# Altium schematic sheet Top Level.SchDoc
size A3; SheetNumber: 1; SheetTotal: 5
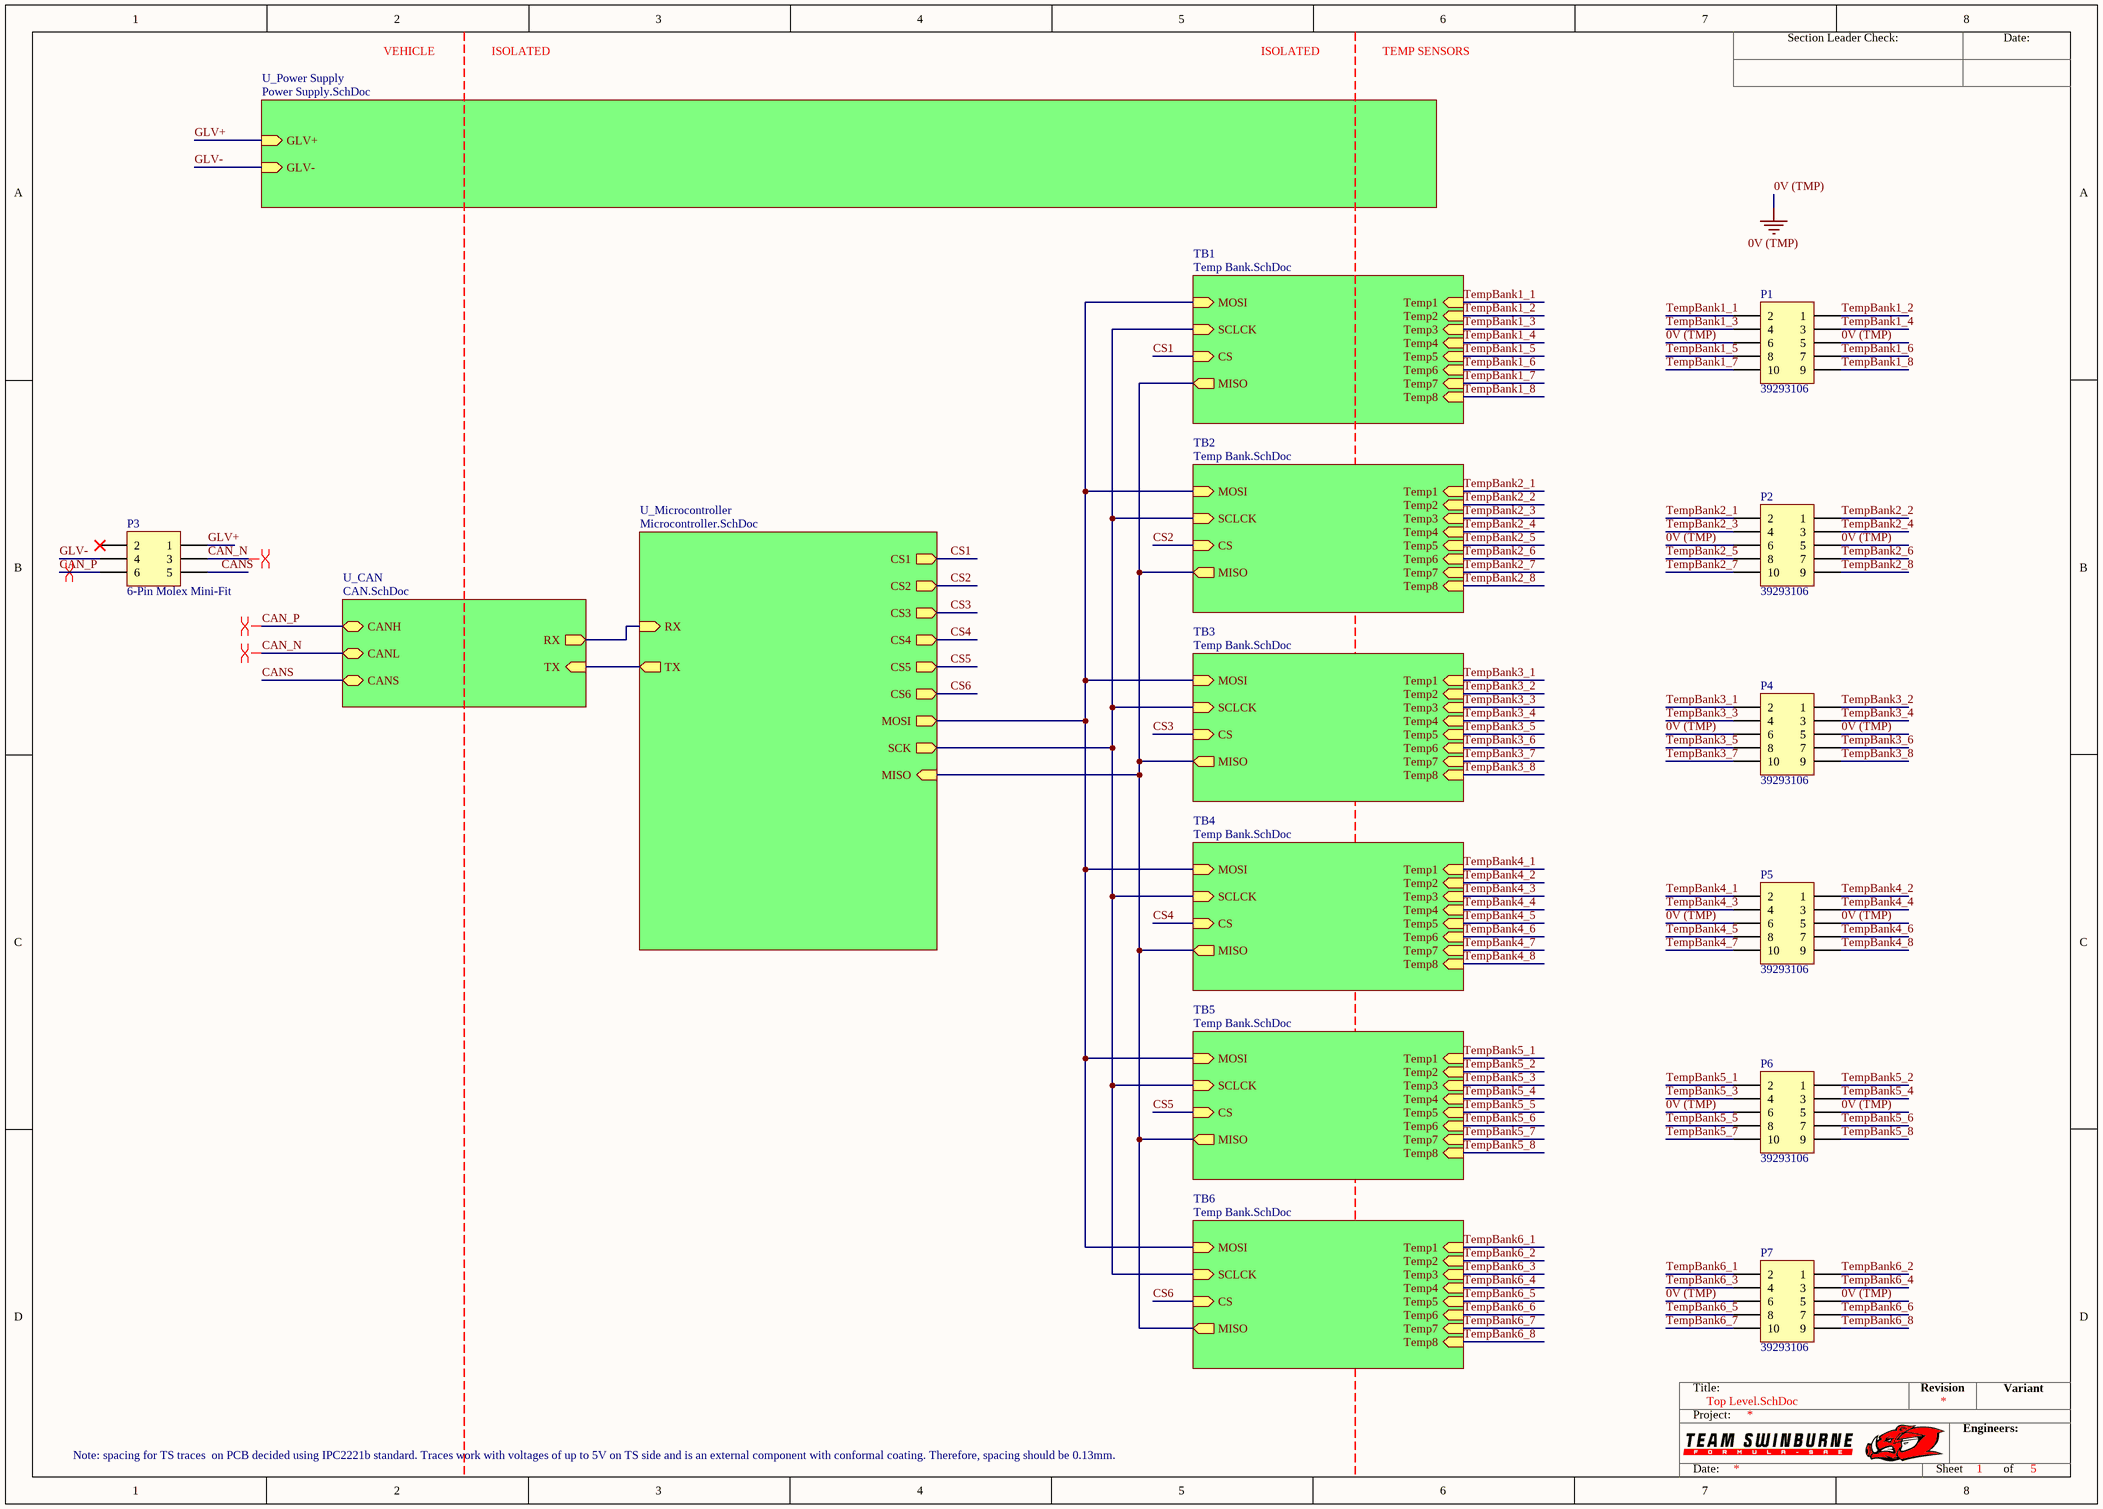
[diagram p0: Top Level.SchDoc]

## Parts
P1  39293106  [39293106]
P2  39293106  [39293106]
P3  6-Pin Molex Mini-Fit  [6-Pin Molex Mini-Fit]
P4  39293106  [39293106]
P5  39293106  [39293106]
P6  39293106  [39293106]
P7  39293106  [39293106]

## Sub-sheets
TB1 = Temp Bank.SchDoc: MOSI (in), SCLCK (in), CS (in), MISO (out), Temp4 (in), Temp5 (in), Temp6 (in), Temp1 (in), Temp2 (in), Temp3 (in), Temp7 (in), Temp8 (in)
TB2 = Temp Bank.SchDoc: MOSI (in), SCLCK (in), CS (in), MISO (out), Temp1 (in), Temp2 (in), Temp3 (in), Temp4 (in), Temp5 (in), Temp6 (in), Temp7 (in), Temp8 (in)
TB3 = Temp Bank.SchDoc: MOSI (in), SCLCK (in), CS (in), MISO (out), Temp1 (in), Temp2 (in), Temp3 (in), Temp4 (in), Temp5 (in), Temp6 (in), Temp7 (in), Temp8 (in)
TB4 = Temp Bank.SchDoc: MOSI (in), SCLCK (in), CS (in), MISO (out), Temp1 (in), Temp2 (in), Temp3 (in), Temp4 (in), Temp5 (in), Temp6 (in), Temp7 (in), Temp8 (in)
TB5 = Temp Bank.SchDoc: MOSI (in), SCLCK (in), CS (in), MISO (out), Temp1 (in), Temp2 (in), Temp3 (in), Temp4 (in), Temp5 (in), Temp6 (in), Temp7 (in), Temp8 (in)
TB6 = Temp Bank.SchDoc: MOSI (in), SCLCK (in), CS (in), MISO (out), Temp1 (in), Temp2 (in), Temp3 (in), Temp4 (in), Temp5 (in), Temp6 (in), Temp7 (in), Temp8 (in)
U_CAN = CAN.SchDoc: CANH (bidir), RX (out), TX (in), CANL (bidir), CANS (bidir)
U_Microcontroller = Microcontroller.SchDoc: CS1 (out), CS2 (out), CS3 (out), CS4 (out), CS5 (out), MOSI (out), CS6 (out), SCK (out), RX (in), TX (out), MISO (in)
U_Power Supply = Power Supply.SchDoc: GLV+ (in), GLV- (in)

## Nets
0V (TMP): P1.5 P1.6 P2.5 P2.6 P4.5 P4.6 P5.5 P5.6 P6.5 P6.6 P7.5 P7.6
CAN_N: P3.3 ; sheet U_CAN/CANL
CAN_P: P3.6 ; sheet U_CAN/CANH
CANS: P3.5 ; sheet U_CAN/CANS
CS1: sheet U_Microcontroller/CS1, sheet TB1/CS
CS2: sheet U_Microcontroller/CS2, sheet TB2/CS
CS3: sheet U_Microcontroller/CS3, sheet TB3/CS
CS4: sheet U_Microcontroller/CS4, sheet TB4/CS
CS5: sheet U_Microcontroller/CS5, sheet TB5/CS
CS6: sheet U_Microcontroller/CS6, sheet TB6/CS
GLV+: P3.1 ; sheet U_Power Supply/GLV+
GLV-: P3.4 ; sheet U_Power Supply/GLV-
TempBank1_1: P1.2 ; sheet TB1/Temp1
TempBank1_2: P1.1 ; sheet TB1/Temp2
TempBank1_3: P1.4 ; sheet TB1/Temp3
TempBank1_4: P1.3 ; sheet TB1/Temp4
TempBank1_5: P1.8 ; sheet TB1/Temp5
TempBank1_6: P1.7 ; sheet TB1/Temp6
TempBank1_7: P1.10 ; sheet TB1/Temp7
TempBank1_8: P1.9 ; sheet TB1/Temp8
TempBank2_1: P2.2 ; sheet TB2/Temp1
TempBank2_2: P2.1 ; sheet TB2/Temp2
TempBank2_3: P2.4 ; sheet TB2/Temp3
TempBank2_4: P2.3 ; sheet TB2/Temp4
TempBank2_5: P2.8 ; sheet TB2/Temp5
TempBank2_6: P2.7 ; sheet TB2/Temp6
TempBank2_7: P2.10 ; sheet TB2/Temp7
TempBank2_8: P2.9 ; sheet TB2/Temp8
TempBank3_1: P4.2 ; sheet TB3/Temp1
TempBank3_2: P4.1 ; sheet TB3/Temp2
TempBank3_3: P4.4 ; sheet TB3/Temp3
TempBank3_4: P4.3 ; sheet TB3/Temp4
TempBank3_5: P4.8 ; sheet TB3/Temp5
TempBank3_6: P4.7 ; sheet TB3/Temp6
TempBank3_7: P4.10 ; sheet TB3/Temp7
TempBank3_8: P4.9 ; sheet TB3/Temp8
TempBank4_1: P5.2 ; sheet TB4/Temp1
TempBank4_2: P5.1 ; sheet TB4/Temp2
TempBank4_3: P5.4 ; sheet TB4/Temp3
TempBank4_4: P5.3 ; sheet TB4/Temp4
TempBank4_5: P5.8 ; sheet TB4/Temp5
TempBank4_6: P5.7 ; sheet TB4/Temp6
TempBank4_7: P5.10 ; sheet TB4/Temp7
TempBank4_8: P5.9 ; sheet TB4/Temp8
TempBank5_1: P6.2 ; sheet TB5/Temp1
TempBank5_2: P6.1 ; sheet TB5/Temp2
TempBank5_3: P6.4 ; sheet TB5/Temp3
TempBank5_4: P6.3 ; sheet TB5/Temp4
TempBank5_5: P6.8 ; sheet TB5/Temp5
TempBank5_6: P6.7 ; sheet TB5/Temp6
TempBank5_7: P6.10 ; sheet TB5/Temp7
TempBank5_8: P6.9 ; sheet TB5/Temp8
TempBank6_1: P7.2 ; sheet TB6/Temp1
TempBank6_2: P7.1 ; sheet TB6/Temp2
TempBank6_3: P7.4 ; sheet TB6/Temp3
TempBank6_4: P7.3 ; sheet TB6/Temp4
TempBank6_5: P7.8 ; sheet TB6/Temp5
TempBank6_6: P7.7 ; sheet TB6/Temp6
TempBank6_7: P7.10 ; sheet TB6/Temp7
TempBank6_8: P7.9 ; sheet TB6/Temp8
(unnamed): sheet U_CAN/RX, sheet U_Microcontroller/RX
(unnamed): sheet U_CAN/TX, sheet U_Microcontroller/TX
(unnamed): sheet U_Microcontroller/MOSI, sheet TB1/MOSI, sheet TB2/MOSI, sheet TB3/MOSI, sheet TB4/MOSI, sheet TB5/MOSI, sheet TB6/MOSI
(unnamed): sheet U_Microcontroller/SCK, sheet TB1/SCLCK, sheet TB2/SCLCK, sheet TB3/SCLCK, sheet TB4/SCLCK, sheet TB5/SCLCK, sheet TB6/SCLCK
(unnamed): sheet U_Microcontroller/MISO, sheet TB1/MISO, sheet TB2/MISO, sheet TB3/MISO, sheet TB4/MISO, sheet TB5/MISO, sheet TB6/MISO

Not connected (* = marked no-connect by the designer): P3 2*

## Layout directives
differential pair: CAN_N, CAN_P

## Notes on the sheet
- VEHICLE
- ISOLATED
- TEMP SENSORS
- Note: spacing for TS traces  on PCB decided using IPC2221b standard. Traces work with voltages of up to 5V on TS side and is an external component with conformal coating. Therefore, spacing should be 0.13mm.
- Section Leader Check:
- Date:
- Title:
- Revision
- Variant
- Project:
- Engineers:
- Sheet
- of

## Library data of the parts
P1 P2 P4-P7 = 39293106: Pitch: 4.2mm; Row Spacing: 5.5mm; Angle: 0; Flange: No; Contact: Tin; Part Number: 39293106; Positions: 10; Digikey Part Number: WM3847-ND
P3 = CMP-CONN-0004-1: 6-Pin Molex Mini-Fit Connector Header 6 pin mini fit